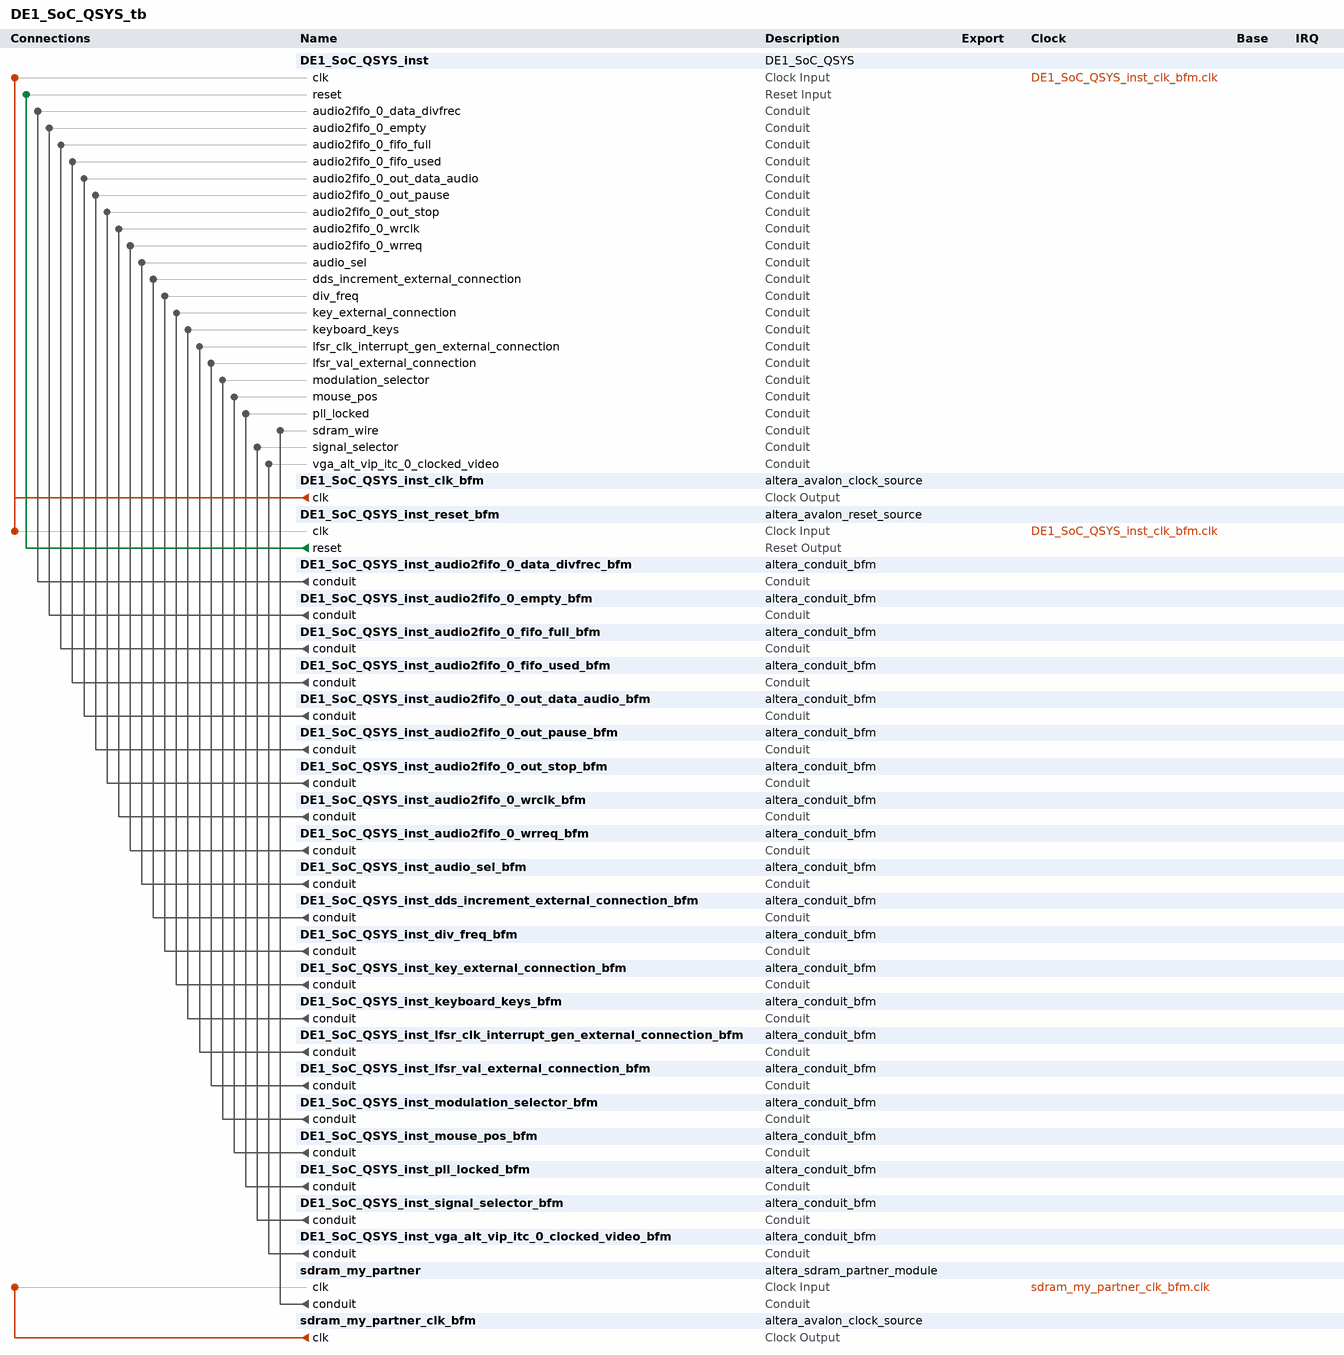
[diagram p0: system contents]
# Platform Designer (Qsys) system DE1_SoC_QSYS_tb, Cyclone V 5CSEMA5F31C6
# Parameters at their usual value, and those the tool derives, are not listed.
package require -exact qsys 14.1
create_system DE1_SoC_QSYS_tb
set_project_property DEVICE_FAMILY {Cyclone V}
set_project_property DEVICE 5CSEMA5F31C6

add_instance DE1_SoC_QSYS_inst DE1_SoC_QSYS 1.0

add_instance DE1_SoC_QSYS_inst_clk_bfm altera_avalon_clock_source 14.1

add_instance DE1_SoC_QSYS_inst_reset_bfm altera_avalon_reset_source 14.1
set_instance_parameter_value DE1_SoC_QSYS_inst_reset_bfm ASSERT_HIGH_RESET 0
set_instance_parameter_value DE1_SoC_QSYS_inst_reset_bfm INITIAL_RESET_CYCLES 50

add_instance DE1_SoC_QSYS_inst_audio2fifo_0_data_divfrec_bfm altera_conduit_bfm 14.1
set_instance_parameter_value DE1_SoC_QSYS_inst_audio2fifo_0_data_divfrec_bfm CLOCKED_SIGNAL false
set_instance_parameter_value DE1_SoC_QSYS_inst_audio2fifo_0_data_divfrec_bfm ENABLE_RESET false
set_instance_parameter_value DE1_SoC_QSYS_inst_audio2fifo_0_data_divfrec_bfm SIGNAL_DIRECTIONS input
set_instance_parameter_value DE1_SoC_QSYS_inst_audio2fifo_0_data_divfrec_bfm SIGNAL_WIDTHS 32

add_instance DE1_SoC_QSYS_inst_audio2fifo_0_empty_bfm altera_conduit_bfm 14.1
set_instance_parameter_value DE1_SoC_QSYS_inst_audio2fifo_0_empty_bfm CLOCKED_SIGNAL false
set_instance_parameter_value DE1_SoC_QSYS_inst_audio2fifo_0_empty_bfm ENABLE_RESET false
set_instance_parameter_value DE1_SoC_QSYS_inst_audio2fifo_0_empty_bfm SIGNAL_DIRECTIONS output
set_instance_parameter_value DE1_SoC_QSYS_inst_audio2fifo_0_empty_bfm SIGNAL_WIDTHS 1

add_instance DE1_SoC_QSYS_inst_audio2fifo_0_fifo_full_bfm altera_conduit_bfm 14.1
set_instance_parameter_value DE1_SoC_QSYS_inst_audio2fifo_0_fifo_full_bfm CLOCKED_SIGNAL false
set_instance_parameter_value DE1_SoC_QSYS_inst_audio2fifo_0_fifo_full_bfm ENABLE_RESET false
set_instance_parameter_value DE1_SoC_QSYS_inst_audio2fifo_0_fifo_full_bfm SIGNAL_DIRECTIONS output
set_instance_parameter_value DE1_SoC_QSYS_inst_audio2fifo_0_fifo_full_bfm SIGNAL_WIDTHS 1

add_instance DE1_SoC_QSYS_inst_audio2fifo_0_fifo_used_bfm altera_conduit_bfm 14.1
set_instance_parameter_value DE1_SoC_QSYS_inst_audio2fifo_0_fifo_used_bfm CLOCKED_SIGNAL false
set_instance_parameter_value DE1_SoC_QSYS_inst_audio2fifo_0_fifo_used_bfm ENABLE_RESET false
set_instance_parameter_value DE1_SoC_QSYS_inst_audio2fifo_0_fifo_used_bfm SIGNAL_DIRECTIONS output
set_instance_parameter_value DE1_SoC_QSYS_inst_audio2fifo_0_fifo_used_bfm SIGNAL_WIDTHS 12

add_instance DE1_SoC_QSYS_inst_audio2fifo_0_out_data_audio_bfm altera_conduit_bfm 14.1
set_instance_parameter_value DE1_SoC_QSYS_inst_audio2fifo_0_out_data_audio_bfm CLOCKED_SIGNAL false
set_instance_parameter_value DE1_SoC_QSYS_inst_audio2fifo_0_out_data_audio_bfm ENABLE_RESET false
set_instance_parameter_value DE1_SoC_QSYS_inst_audio2fifo_0_out_data_audio_bfm SIGNAL_DIRECTIONS input
set_instance_parameter_value DE1_SoC_QSYS_inst_audio2fifo_0_out_data_audio_bfm SIGNAL_WIDTHS 32

add_instance DE1_SoC_QSYS_inst_audio2fifo_0_out_pause_bfm altera_conduit_bfm 14.1
set_instance_parameter_value DE1_SoC_QSYS_inst_audio2fifo_0_out_pause_bfm CLOCKED_SIGNAL false
set_instance_parameter_value DE1_SoC_QSYS_inst_audio2fifo_0_out_pause_bfm ENABLE_RESET false
set_instance_parameter_value DE1_SoC_QSYS_inst_audio2fifo_0_out_pause_bfm SIGNAL_DIRECTIONS input
set_instance_parameter_value DE1_SoC_QSYS_inst_audio2fifo_0_out_pause_bfm SIGNAL_WIDTHS 1

add_instance DE1_SoC_QSYS_inst_audio2fifo_0_out_stop_bfm altera_conduit_bfm 14.1
set_instance_parameter_value DE1_SoC_QSYS_inst_audio2fifo_0_out_stop_bfm CLOCKED_SIGNAL false
set_instance_parameter_value DE1_SoC_QSYS_inst_audio2fifo_0_out_stop_bfm ENABLE_RESET false
set_instance_parameter_value DE1_SoC_QSYS_inst_audio2fifo_0_out_stop_bfm SIGNAL_DIRECTIONS input
set_instance_parameter_value DE1_SoC_QSYS_inst_audio2fifo_0_out_stop_bfm SIGNAL_WIDTHS 1

add_instance DE1_SoC_QSYS_inst_audio2fifo_0_wrclk_bfm altera_conduit_bfm 14.1
set_instance_parameter_value DE1_SoC_QSYS_inst_audio2fifo_0_wrclk_bfm CLOCKED_SIGNAL false
set_instance_parameter_value DE1_SoC_QSYS_inst_audio2fifo_0_wrclk_bfm ENABLE_RESET false
set_instance_parameter_value DE1_SoC_QSYS_inst_audio2fifo_0_wrclk_bfm SIGNAL_DIRECTIONS input
set_instance_parameter_value DE1_SoC_QSYS_inst_audio2fifo_0_wrclk_bfm SIGNAL_WIDTHS 1

add_instance DE1_SoC_QSYS_inst_audio2fifo_0_wrreq_bfm altera_conduit_bfm 14.1
set_instance_parameter_value DE1_SoC_QSYS_inst_audio2fifo_0_wrreq_bfm CLOCKED_SIGNAL false
set_instance_parameter_value DE1_SoC_QSYS_inst_audio2fifo_0_wrreq_bfm ENABLE_RESET false
set_instance_parameter_value DE1_SoC_QSYS_inst_audio2fifo_0_wrreq_bfm SIGNAL_DIRECTIONS input
set_instance_parameter_value DE1_SoC_QSYS_inst_audio2fifo_0_wrreq_bfm SIGNAL_WIDTHS 1

add_instance DE1_SoC_QSYS_inst_audio_sel_bfm altera_conduit_bfm 14.1
set_instance_parameter_value DE1_SoC_QSYS_inst_audio_sel_bfm CLOCKED_SIGNAL false
set_instance_parameter_value DE1_SoC_QSYS_inst_audio_sel_bfm ENABLE_RESET false
set_instance_parameter_value DE1_SoC_QSYS_inst_audio_sel_bfm SIGNAL_DIRECTIONS input
set_instance_parameter_value DE1_SoC_QSYS_inst_audio_sel_bfm SIGNAL_WIDTHS 1

add_instance DE1_SoC_QSYS_inst_dds_increment_external_connection_bfm altera_conduit_bfm 14.1
set_instance_parameter_value DE1_SoC_QSYS_inst_dds_increment_external_connection_bfm CLOCKED_SIGNAL false
set_instance_parameter_value DE1_SoC_QSYS_inst_dds_increment_external_connection_bfm ENABLE_RESET false
set_instance_parameter_value DE1_SoC_QSYS_inst_dds_increment_external_connection_bfm SIGNAL_DIRECTIONS input
set_instance_parameter_value DE1_SoC_QSYS_inst_dds_increment_external_connection_bfm SIGNAL_WIDTHS 32

add_instance DE1_SoC_QSYS_inst_div_freq_bfm altera_conduit_bfm 14.1
set_instance_parameter_value DE1_SoC_QSYS_inst_div_freq_bfm CLOCKED_SIGNAL false
set_instance_parameter_value DE1_SoC_QSYS_inst_div_freq_bfm ENABLE_RESET false
set_instance_parameter_value DE1_SoC_QSYS_inst_div_freq_bfm SIGNAL_DIRECTIONS input
set_instance_parameter_value DE1_SoC_QSYS_inst_div_freq_bfm SIGNAL_WIDTHS 32

add_instance DE1_SoC_QSYS_inst_key_external_connection_bfm altera_conduit_bfm 14.1
set_instance_parameter_value DE1_SoC_QSYS_inst_key_external_connection_bfm CLOCKED_SIGNAL false
set_instance_parameter_value DE1_SoC_QSYS_inst_key_external_connection_bfm ENABLE_RESET false
set_instance_parameter_value DE1_SoC_QSYS_inst_key_external_connection_bfm SIGNAL_DIRECTIONS output
set_instance_parameter_value DE1_SoC_QSYS_inst_key_external_connection_bfm SIGNAL_WIDTHS 4

add_instance DE1_SoC_QSYS_inst_keyboard_keys_bfm altera_conduit_bfm 14.1
set_instance_parameter_value DE1_SoC_QSYS_inst_keyboard_keys_bfm CLOCKED_SIGNAL false
set_instance_parameter_value DE1_SoC_QSYS_inst_keyboard_keys_bfm ENABLE_RESET false
set_instance_parameter_value DE1_SoC_QSYS_inst_keyboard_keys_bfm SIGNAL_DIRECTIONS output
set_instance_parameter_value DE1_SoC_QSYS_inst_keyboard_keys_bfm SIGNAL_WIDTHS 32

add_instance DE1_SoC_QSYS_inst_lfsr_clk_interrupt_gen_external_connection_bfm altera_conduit_bfm 14.1
set_instance_parameter_value DE1_SoC_QSYS_inst_lfsr_clk_interrupt_gen_external_connection_bfm CLOCKED_SIGNAL false
set_instance_parameter_value DE1_SoC_QSYS_inst_lfsr_clk_interrupt_gen_external_connection_bfm ENABLE_RESET false
set_instance_parameter_value DE1_SoC_QSYS_inst_lfsr_clk_interrupt_gen_external_connection_bfm SIGNAL_DIRECTIONS output
set_instance_parameter_value DE1_SoC_QSYS_inst_lfsr_clk_interrupt_gen_external_connection_bfm SIGNAL_WIDTHS 1

add_instance DE1_SoC_QSYS_inst_lfsr_val_external_connection_bfm altera_conduit_bfm 14.1
set_instance_parameter_value DE1_SoC_QSYS_inst_lfsr_val_external_connection_bfm CLOCKED_SIGNAL false
set_instance_parameter_value DE1_SoC_QSYS_inst_lfsr_val_external_connection_bfm ENABLE_RESET false
set_instance_parameter_value DE1_SoC_QSYS_inst_lfsr_val_external_connection_bfm SIGNAL_DIRECTIONS output
set_instance_parameter_value DE1_SoC_QSYS_inst_lfsr_val_external_connection_bfm SIGNAL_WIDTHS 32

add_instance DE1_SoC_QSYS_inst_modulation_selector_bfm altera_conduit_bfm 14.1
set_instance_parameter_value DE1_SoC_QSYS_inst_modulation_selector_bfm CLOCKED_SIGNAL false
set_instance_parameter_value DE1_SoC_QSYS_inst_modulation_selector_bfm ENABLE_RESET false
set_instance_parameter_value DE1_SoC_QSYS_inst_modulation_selector_bfm SIGNAL_DIRECTIONS input
set_instance_parameter_value DE1_SoC_QSYS_inst_modulation_selector_bfm SIGNAL_WIDTHS 4

add_instance DE1_SoC_QSYS_inst_mouse_pos_bfm altera_conduit_bfm 14.1
set_instance_parameter_value DE1_SoC_QSYS_inst_mouse_pos_bfm CLOCKED_SIGNAL false
set_instance_parameter_value DE1_SoC_QSYS_inst_mouse_pos_bfm ENABLE_RESET false
set_instance_parameter_value DE1_SoC_QSYS_inst_mouse_pos_bfm SIGNAL_DIRECTIONS output
set_instance_parameter_value DE1_SoC_QSYS_inst_mouse_pos_bfm SIGNAL_WIDTHS 32

add_instance DE1_SoC_QSYS_inst_pll_locked_bfm altera_conduit_bfm 14.1
set_instance_parameter_value DE1_SoC_QSYS_inst_pll_locked_bfm CLOCKED_SIGNAL false
set_instance_parameter_value DE1_SoC_QSYS_inst_pll_locked_bfm ENABLE_RESET false
set_instance_parameter_value DE1_SoC_QSYS_inst_pll_locked_bfm SIGNAL_DIRECTIONS input
set_instance_parameter_value DE1_SoC_QSYS_inst_pll_locked_bfm SIGNAL_WIDTHS 1

add_instance DE1_SoC_QSYS_inst_signal_selector_bfm altera_conduit_bfm 14.1
set_instance_parameter_value DE1_SoC_QSYS_inst_signal_selector_bfm CLOCKED_SIGNAL false
set_instance_parameter_value DE1_SoC_QSYS_inst_signal_selector_bfm ENABLE_RESET false
set_instance_parameter_value DE1_SoC_QSYS_inst_signal_selector_bfm SIGNAL_DIRECTIONS input
set_instance_parameter_value DE1_SoC_QSYS_inst_signal_selector_bfm SIGNAL_WIDTHS 8

add_instance DE1_SoC_QSYS_inst_vga_alt_vip_itc_0_clocked_video_bfm altera_conduit_bfm 14.1
set_instance_parameter_value DE1_SoC_QSYS_inst_vga_alt_vip_itc_0_clocked_video_bfm CLOCKED_SIGNAL false
set_instance_parameter_value DE1_SoC_QSYS_inst_vga_alt_vip_itc_0_clocked_video_bfm ENABLE_RESET false
set_instance_parameter_value DE1_SoC_QSYS_inst_vga_alt_vip_itc_0_clocked_video_bfm SIGNAL_DIRECTIONS output,input,input,input,input,input,input,input,input
set_instance_parameter_value DE1_SoC_QSYS_inst_vga_alt_vip_itc_0_clocked_video_bfm SIGNAL_ROLES vid_clk,vid_data,underflow,vid_datavalid,vid_v_sync,vid_h_sync,vid_f,vid_h,vid_v
set_instance_parameter_value DE1_SoC_QSYS_inst_vga_alt_vip_itc_0_clocked_video_bfm SIGNAL_WIDTHS 1,24,1,1,1,1,1,1,1

add_instance sdram_my_partner altera_sdram_partner_module 11.0
set_instance_parameter_value sdram_my_partner CONTR_NAME DE1_SoC_QSYS_sdram
set_instance_parameter_value sdram_my_partner SDRAM_COL_WIDTH 10
set_instance_parameter_value sdram_my_partner SDRAM_DATA_WIDTH 16
set_instance_parameter_value sdram_my_partner SDRAM_ROW_WIDTH 13

add_instance sdram_my_partner_clk_bfm altera_avalon_clock_source 14.1
set_instance_parameter_value sdram_my_partner_clk_bfm CLOCK_RATE 142857142

# connections
add_connection DE1_SoC_QSYS_inst_clk_bfm.clk DE1_SoC_QSYS_inst.clk clock
add_connection DE1_SoC_QSYS_inst_clk_bfm.clk DE1_SoC_QSYS_inst_reset_bfm.clk clock
add_connection sdram_my_partner_clk_bfm.clk sdram_my_partner.clk clock
add_connection DE1_SoC_QSYS_inst_reset_bfm.reset DE1_SoC_QSYS_inst.reset reset
add_connection DE1_SoC_QSYS_inst_audio2fifo_0_data_divfrec_bfm.conduit DE1_SoC_QSYS_inst.audio2fifo_0_data_divfrec conduit
add_connection DE1_SoC_QSYS_inst_audio2fifo_0_empty_bfm.conduit DE1_SoC_QSYS_inst.audio2fifo_0_empty conduit
add_connection DE1_SoC_QSYS_inst_audio2fifo_0_fifo_full_bfm.conduit DE1_SoC_QSYS_inst.audio2fifo_0_fifo_full conduit
add_connection DE1_SoC_QSYS_inst_audio2fifo_0_fifo_used_bfm.conduit DE1_SoC_QSYS_inst.audio2fifo_0_fifo_used conduit
add_connection DE1_SoC_QSYS_inst_audio2fifo_0_out_data_audio_bfm.conduit DE1_SoC_QSYS_inst.audio2fifo_0_out_data_audio conduit
add_connection DE1_SoC_QSYS_inst_audio2fifo_0_out_pause_bfm.conduit DE1_SoC_QSYS_inst.audio2fifo_0_out_pause conduit
add_connection DE1_SoC_QSYS_inst_audio2fifo_0_out_stop_bfm.conduit DE1_SoC_QSYS_inst.audio2fifo_0_out_stop conduit
add_connection DE1_SoC_QSYS_inst_audio2fifo_0_wrclk_bfm.conduit DE1_SoC_QSYS_inst.audio2fifo_0_wrclk conduit
add_connection DE1_SoC_QSYS_inst_audio2fifo_0_wrreq_bfm.conduit DE1_SoC_QSYS_inst.audio2fifo_0_wrreq conduit
add_connection DE1_SoC_QSYS_inst_audio_sel_bfm.conduit DE1_SoC_QSYS_inst.audio_sel conduit
add_connection DE1_SoC_QSYS_inst_dds_increment_external_connection_bfm.conduit DE1_SoC_QSYS_inst.dds_increment_external_connection conduit
add_connection DE1_SoC_QSYS_inst_div_freq_bfm.conduit DE1_SoC_QSYS_inst.div_freq conduit
add_connection DE1_SoC_QSYS_inst_key_external_connection_bfm.conduit DE1_SoC_QSYS_inst.key_external_connection conduit
add_connection DE1_SoC_QSYS_inst_keyboard_keys_bfm.conduit DE1_SoC_QSYS_inst.keyboard_keys conduit
add_connection DE1_SoC_QSYS_inst_lfsr_clk_interrupt_gen_external_connection_bfm.conduit DE1_SoC_QSYS_inst.lfsr_clk_interrupt_gen_external_connection conduit
add_connection DE1_SoC_QSYS_inst_lfsr_val_external_connection_bfm.conduit DE1_SoC_QSYS_inst.lfsr_val_external_connection conduit
add_connection DE1_SoC_QSYS_inst_modulation_selector_bfm.conduit DE1_SoC_QSYS_inst.modulation_selector conduit
add_connection DE1_SoC_QSYS_inst_mouse_pos_bfm.conduit DE1_SoC_QSYS_inst.mouse_pos conduit
add_connection DE1_SoC_QSYS_inst_pll_locked_bfm.conduit DE1_SoC_QSYS_inst.pll_locked conduit
add_connection DE1_SoC_QSYS_inst_signal_selector_bfm.conduit DE1_SoC_QSYS_inst.signal_selector conduit
add_connection DE1_SoC_QSYS_inst_vga_alt_vip_itc_0_clocked_video_bfm.conduit DE1_SoC_QSYS_inst.vga_alt_vip_itc_0_clocked_video conduit
add_connection sdram_my_partner.conduit DE1_SoC_QSYS_inst.sdram_wire conduit

set_interconnect_requirement {$system} qsys_mm.clockCrossingAdapter HANDSHAKE
set_interconnect_requirement {$system} qsys_mm.insertDefaultSlave FALSE
set_interconnect_requirement {$system} qsys_mm.maxAdditionalLatency 1

save_system DE1_SoC_QSYS_tb.qsys
